# Altium project clock_mcu.PrjPcb
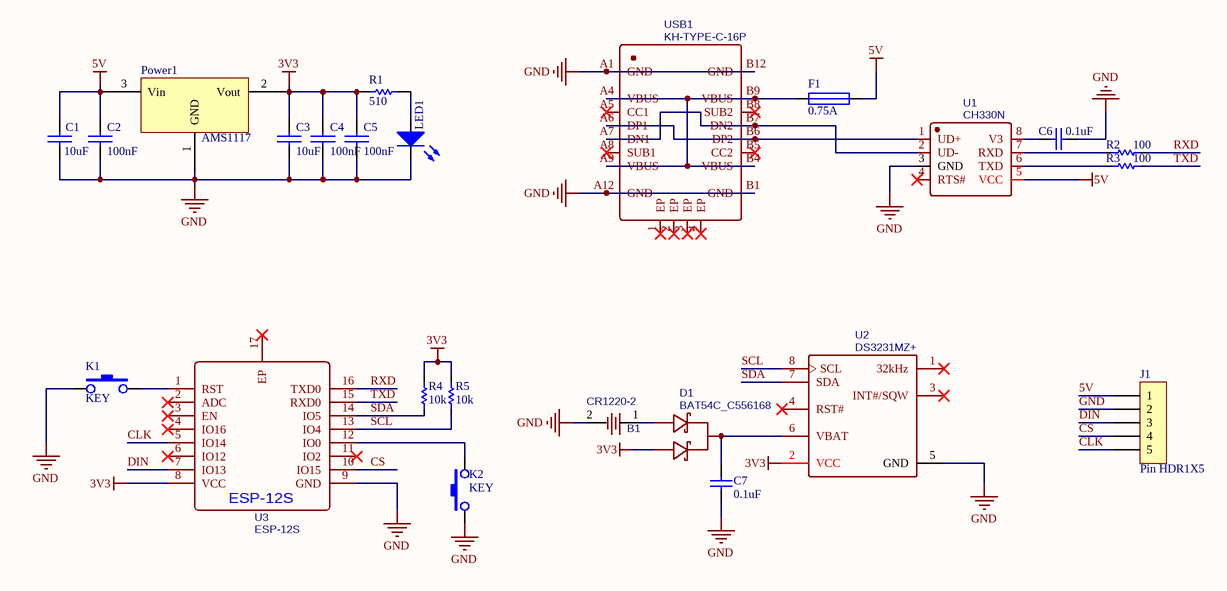
[diagram p0: mcu.SchDoc]
1 sheet, 24 parts. Net scope: global (net labels, ports and power ports of the same name join across sheets).
Board file: mcu.PcbDoc

## Sheet mcu.SchDoc
size A4

### Parts
B1  CR1220-2  [CR1220]
C1  10uF  [0805c]
C2  100nF  [0603C]
C3  10uF  [0805C]
C4  100nF  [0603C]
C5  100nF  [0603C]
C6  0.1uF  [0603C]
C7  0.1uF  [0603C]
D1  BAT54C_C556168  [BAT54C]
F1  0.75A  [1206]
J1  Pin HDR1X5  [Pin HDR1X5/2mm-W]
K1  KEY  [DIP-3X6X5_C]
K2  KEY  [DIP-3X6X5_C]
LED1  LED_RED  [0603LED_R]  (value not drawn)
Power1  AMS1117  [SOT223]
R1  510  [0603R]
R2  100  [0603R]
R3  100  [0603R]
R4  10k  [0603R]
R5  10k  [0603R]
U1  CH330N  [CH340N]
U2  DS3231MZ+  [DS3231MZ+]
U3  ESP-12S  [ESP-12S]
USB1  KH-TYPE-C-16P  [Type-c]

### Nets
3V3: C3.2 C4.2 C5.2 D1.2(+) Power1.2(Vout) R1.1 R4.2 R5.2 U2.2(VCC) U3.8(VCC)
5V: C1.2 C2.2 F1.2 J1.1 Power1.3(Vin) U1.5(VCC)
GND: B1.2 C1.1 C2.1 C3.1 C4.1 C5.1 C6.2 C7.1 J1.2 K1.1 K2.1 LED1.2 Power1.1(GND) U1.3(GND) U2.5(GND) U3.9(GND) USB1.A1(GND) USB1.A12(GND) USB1.B1(GND) USB1.B12(GND)
CLK: J1.5 U3.5(IO14)
CS: J1.4 U3.10(IO15)
DIN: J1.3 U3.7(IO13)
RXD: R2.2 U3.16(TXD0)
SCL: R5.1 U2.8(SCL) U3.13(IO4)
SDA: R4.1 U2.7(SDA) U3.14(IO5)
TXD: R3.2 U3.15(RXD0)
NetB1_1: B1.1 D1.1(+)
NetC6_1: C6.1 U1.8(V3)
NetC7_2: C7.2 D1.3(-) U2.6(VBAT)
NetF1_1: F1.1 USB1.A4(VBUS) USB1.A9(VBUS) USB1.B4(VBUS) USB1.B9(VBUS)
NetK1_3: K1.3 U3.1(RST)
NetK2_3: K2.3 U3.12(IO0)
NetLED1_1: LED1.1 R1.2
NetR2_1: R2.1 U1.7(RXD)
NetR3_1: R3.1 U1.6(TXD)
NetU1_1: U1.1(UD+) USB1.A6(DP1) USB1.B6(DP2)
NetU1_2: U1.2(UD-) USB1.A7(DN1) USB1.B7(DN2)

Not connected (* = marked no-connect by the designer): U1 4(RTS#)*; U2 1(32kHz)* 3(INT#/SQW)* 4(RST#)*; U3 2(ADC)* 3(EN)* 4(IO16)* 6(IO12)* 11(IO2)* 17(EP)*; USB1 1(EP)* 2(EP)* 3(EP)* 4(EP)* A5(CC1)* A8(SUB1)* B5(CC2)* B8(SUB2)*

### Library data of the parts
B1 = CR1220-2: BOM_Manufacturer: Q&J; BOM_Supplier: LCSC; BOM_Manufacturer Part: CR1220-2; image: //image.lceda.cn/szlcsc/C70381.jpg; BOM_Supplier Part: C70381; spicePre: B; spiceSymbolName: CR1220-2
C1-C5 = CAP: 无极性电容
C6 C7 = Cap: Capacitor; Value: 100pF; Published: 8-Jun-2000; LatestRevisionDate: 17-Jul-2002; LatestRevisionNote: Re-released for DXP Platform.; PackageReference: RAD-0.3; Publisher: Altium Limited; PackageDescription: Radial Cap, Thru-Hole; 2 Leads; 0.3 in Pin Spacing
D1 = BAT54C_C556168: BOM_Manufacturer: Slkor(SLKORMICRO Elec.); Contributor: LCSC; BOM_Supplier: LCSC; BOM_Supplier Part: C556168; BOM_Manufacturer Part: BAT54C; spicePre: D; spiceSymbolName: BAT54C_C556168
F1 = FUSE
LED1 = LED: Typical RED, GREEN, YELLOW, AMBER GaAs LED; Published: 8-Jun-2000; LatestRevisionDate: 17-Jul-2002; LatestRevisionNote: Re-released for DXP Platform.; PackageVersion: Feb-2002; PackageReference: 3.2X1.6X1.1; Publisher: Altium Limited; PackageDescription: SM LED; 2 Flat Leads
Power1 = AMS1117: 三端稳压芯片
R1 = RES
R2-R5 = Res1: Resistor; Value: 1K; Published: 8-Jun-2000; LatestRevisionDate: 17-Jul-2002; LatestRevisionNote: Re-released for DXP Platform.; PackageReference: AXIAL-0.3; Publisher: Altium Limited; PackageDescription: Axial Device, Thru-Hole; 2 Leads; 0.3 in Pin Spacing
U1 = CH330N: BOM_Manufacturer: WCH; BOM_Supplier: LCSC; BOM_Manufacturer Part: CH330N; BOM_Supplier Part: C108996; spicePre: U; spiceSymbolName: CH330N
U2 = DS3231MZ+: BOM_Manufacturer: MAXIM; SMT Type: Extend; BOM_Supplier: LCSC; BOM_Manufacturer Part: DS3231MZ+; BOM_Supplier Part: C107410; BOM_JLCPCB SMD: Yes; spicePre: U; spiceSymbolName: DS3231MZ+
U3 = ESP-12S: BOM_Manufacturer: Ai-Thinker; Contributor: LCSC; BOM_Supplier: LCSC; BOM_Manufacturer Part: ESP-12S; BOM_Supplier Part: C82898; spicePre: U; spiceSymbolName: ESP-12S
USB1 = KH-TYPE-C-16P: BOM_Manufacturer: Shenzhen Kinghelm Elec; Contributor: LCSC; BOM_Supplier: LCSC; BOM_Supplier Part: C709357; BOM_Manufacturer Part: KH-TYPE-C-16P; spicePre: U; spiceSymbolName: KH-TYPE-C-16P